# EAGLE schematic MSSRP-RTC (EAGLE 6.6.0)
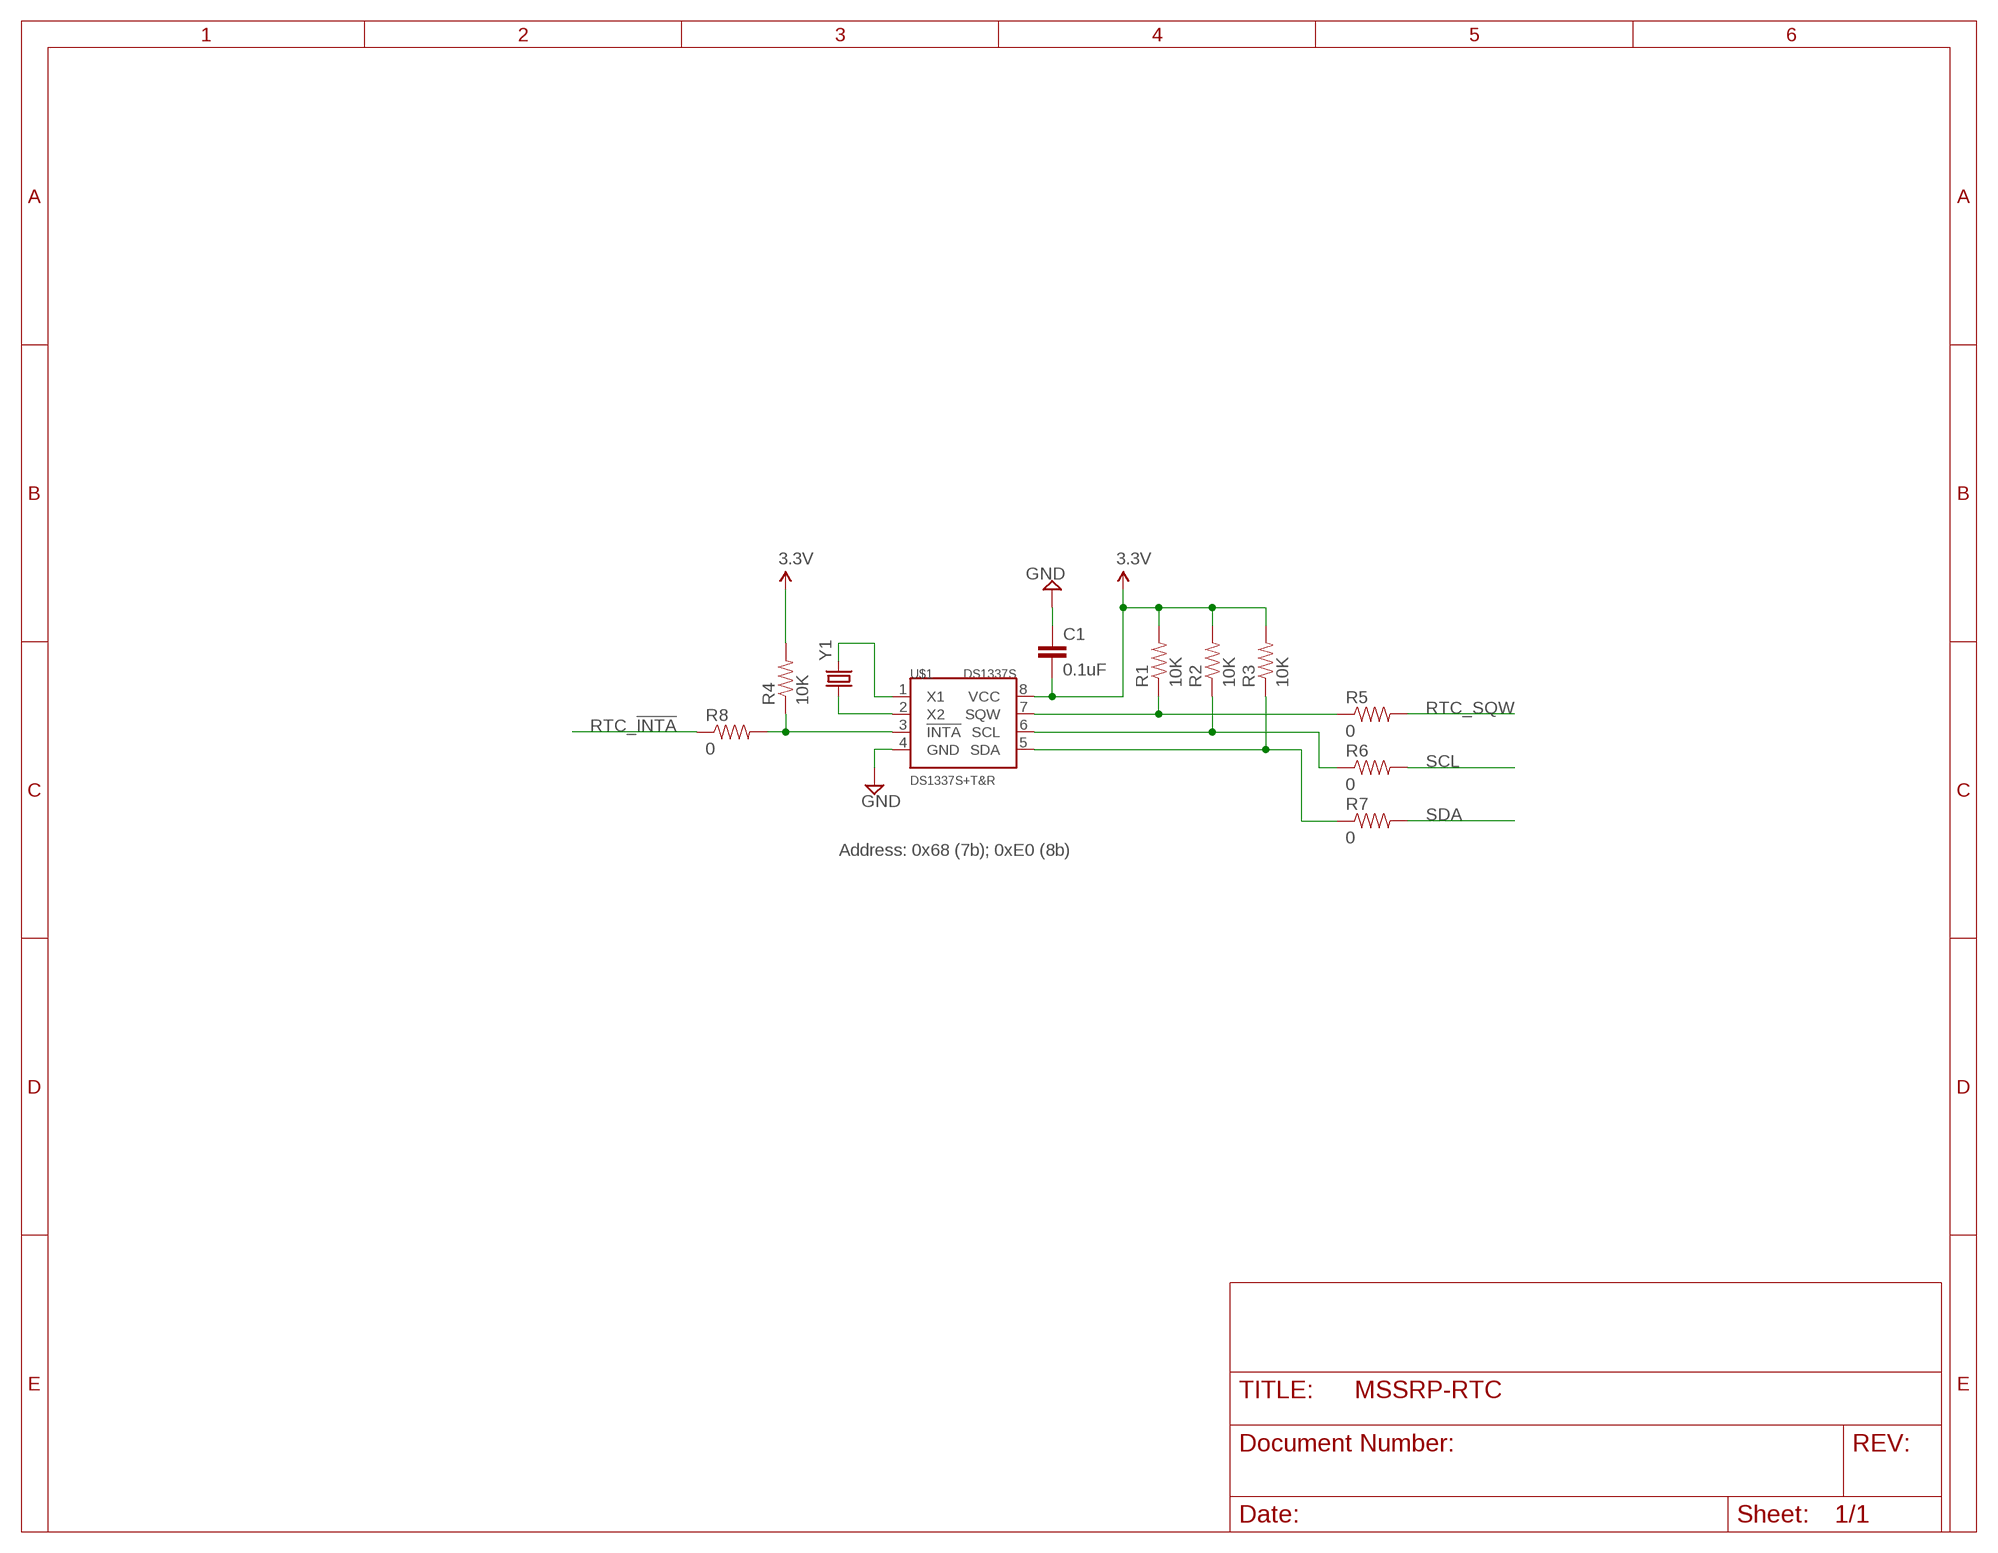
[diagram p0: schematic, sheet 1]

## Parts
C1  0.1uF  0.1UF-25V-5%(0603)  [0603-CAP]
R1  10K  10KOHM1/10W1%(0603)0603  [0603-RES]
R2  10K  10KOHM1/10W1%(0603)0603  [0603-RES]
R3  10K  10KOHM1/10W1%(0603)0603  [0603-RES]
R4  10K  10KOHM1/10W1%(0603)0603  [0603-RES]
R5  0  0OHM1/10W5%(0603)  [0603]
R6  0  0OHM1/10W5%(0603)  [0603]
R7  0  0OHM1/10W5%(0603)  [0603]
R8  0  0OHM1/10W5%(0603)  [0603]
U$1  DS1337S+T&R  [SOIC8]
Y1  CRYSTALSMD  [HC49UP]

## Nets
3.3V: C1.2 R1.2 R2.2 R3.2 R4.2 U$1.8(VCC)
GND: C1.1 U$1.4(GND)
N$1: U$1.2(X2) Y1.1
N$2: U$1.1(X1) Y1.2
N$3: R1.1 R5.1 U$1.7(SQW)
N$4: R2.1 R6.1 U$1.6(SCL)
N$5: R3.1 R7.1 U$1.5(SDA)
N$6: R4.1 R8.2 U$1.3(!INTA)
RTC_!INTA: R8.1
RTC_SQW: R5.2
SCL: R6.2
SDA: R7.2

## Notes on the sheet
- Address: 0x68 (7b); 0xE0 (8b)

## Library data of the parts
C1 = SparkFun-Capacitors:0.1UF-25V-5%(0603): CAP-08604; PROD_ID: CAP-08604
R1-R4 = SparkFun-Resistors:10KOHM1/10W1%(0603): RES-00824; PROD_ID: RES-00824
R5-R8 = SparkFun-Resistors:0OHM1/10W5%(0603): RES-08609; PROD_ID: RES-08609
U$1 = MSSRP-Lib:DS1337S+T&R
Y1 = SparkFun-FreqCtrl:CRYSTAL: Various standard crystals. Proven footprints. Spark Fun Electronics SKU : COM-00534